# Altium schematic sheet MCU_Main.SchDoc
size A4; SheetNumber: 2; SheetTotal: 5
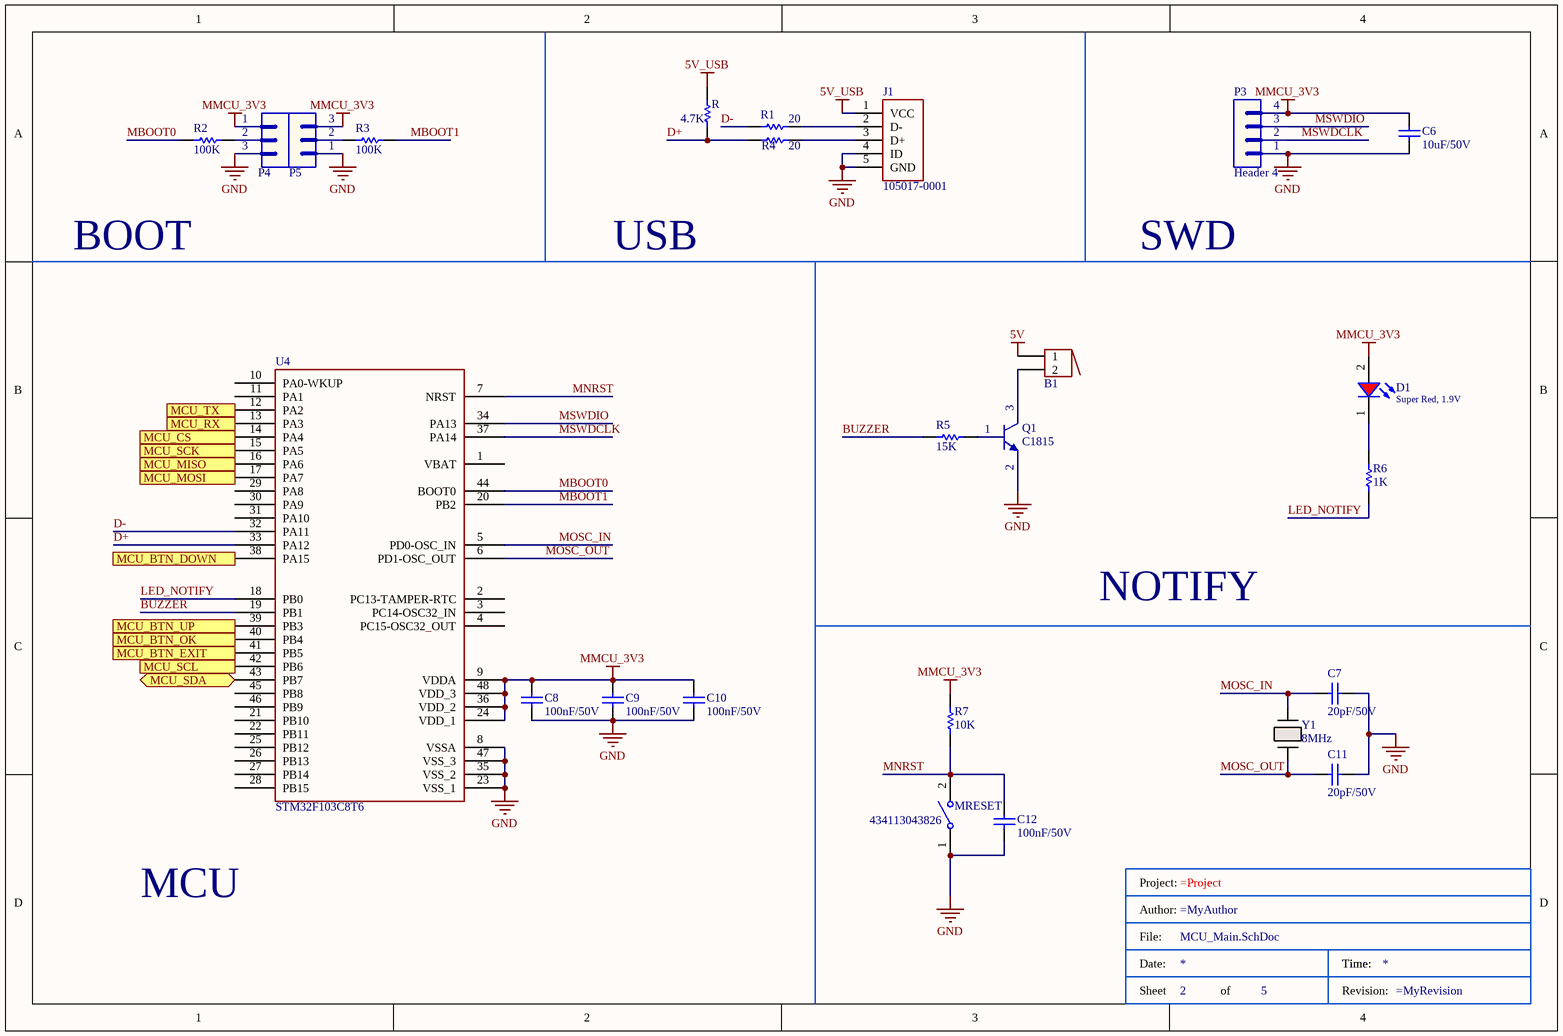
[diagram p0: MCU_Main.SchDoc]

## Parts
*  Title Block  (value not drawn)  (graphical)
B1  Buzzer  [BUZZER]  (value not drawn)
C6  value 10uF/50V  [CAP-SM-0805]  (hidden comment: Cap-10uF-50V-0805)
C7  value 20pF/50V  [CAP-SM-0805]  (hidden comment: Cap-22pF-50V-0805)
C8  value 100nF/50V  [CAP-SM-0805]  (hidden comment: Cap-100nF-50V-0805)
C9  value 100nF/50V  [CAP-SM-0805]  (hidden comment: Cap-100nF-50V-0805)
C10  value 100nF/50V  [CAP-SM-0805]  (hidden comment: Cap-100nF-50V-0805)
C11  value 20pF/50V  [CAP-SM-0805]  (hidden comment: Cap-22pF-50V-0805)
C12  value 100nF/50V  [CAP-SM-0805]  (hidden comment: Cap-100nF-50V-0805)
D1  Super Red, 1.9V  [WL-SMCW_0805]
J1  105017-0001  [Micro-USB-Female]
MRESET  434113043826  [434113043826]
P3  Header 4  [JP4]
P4  Header 3  [JP3]  (value not drawn)
P5  Header 3  [JP3]  (value not drawn)
Q1  C1815  [SOT23_NEX]
R  value 4.7K  [RES-SM-0805]  (hidden comment: Res-4.7K-0805)
R1  value 20  [RES-SM-0805]  (hidden comment: Res-270-0805)
R2  value 100K  [RES-SM-0805]  (hidden comment: Res-100K-0805)
R3  value 100K  [RES-SM-0805]  (hidden comment: Res-100K-0805)
R4  value 20  [RES-SM-0805]  (hidden comment: Res-270-0805)
R5  value 15K  [RES-SM-0805]  (hidden comment: Res-15K-0805)
R6  value 1K  [RES-SM-0805]  (hidden comment: Res-1K-0805)
R7  value 10K  [RES-SM-0805]  (hidden comment: Res-10k-0805)
U4  STM32F103C8T6  [LQFP-48]
Y1  8MHz  [xtal2_CX5032GB_AVX-L]

## Ports
MCU_BTN_DOWN (out), MCU_BTN_EXIT (out), MCU_BTN_OK (out), MCU_BTN_UP (out), MCU_CS (out), MCU_MISO (in), MCU_MOSI (out), MCU_RX (in), MCU_SCK (out), MCU_SCL (out), MCU_SDA (bidir), MCU_TX (out)

## Nets
5V: B1.1
5V_USB: J1.1(VCC) R.1
GND: C6.1 C7.1 C8.2 C9.2 C10.2 C11.1 C12.1 J1.4(ID) J1.5(GND) MRESET.1 P3.1 P4.3 P5.1 Q1.2(E) U4.8(VSSA) U4.23(VSS_1) U4.35(VSS_2) U4.47(VSS_3)
MMCU_3V3: C6.2 C8.1 C9.1 C10.1 D1.2(A) P3.4 P4.1 P5.3 R7.2 U4.9(VDDA) U4.24(VDD_1) U4.36(VDD_2) U4.48(VDD_3)
BUZZER: R5.1 U4.19(PB1)
D+: R.2 R4.2 U4.33(PA12)
D-: R1.2 U4.32(PA11)
LED_NOTIFY: R6.1 U4.18(PB0)
MBOOT0: R2.1 U4.44(BOOT0)
MBOOT1: R3.2 U4.20(PB2)
MCU_BTN_DOWN: U4.38(PA15) ; port MCU_BTN_DOWN
MCU_BTN_EXIT: U4.41(PB5) ; port MCU_BTN_EXIT
MCU_BTN_OK: U4.40(PB4) ; port MCU_BTN_OK
MCU_BTN_UP: U4.39(PB3) ; port MCU_BTN_UP
MCU_CS: U4.14(PA4) ; port MCU_CS
MCU_MISO: U4.16(PA6) ; port MCU_MISO
MCU_MOSI: U4.17(PA7) ; port MCU_MOSI
MCU_RX: U4.13(PA3) ; port MCU_RX
MCU_SCK: U4.15(PA5) ; port MCU_SCK
MCU_SCL: U4.42(PB6) ; port MCU_SCL
MCU_SDA: U4.43(PB7) ; port MCU_SDA
MCU_TX: U4.12(PA2) ; port MCU_TX
MNRST: C12.2 MRESET.2 R7.1 U4.7(NRST)
MOSC_IN: C7.2 U4.5(PD0-OSC_IN) Y1.1
MOSC_OUT: C11.2 U4.6(PD1-OSC_OUT) Y1.2
MSWDCLK: P3.2 U4.37(PA14)
MSWDIO: P3.3 U4.34(PA13)
NetB1_2: B1.2 Q1.3(C)
NetD1_1: D1.1(K) R6.2
NetJ1_2: J1.2(D-) R1.1
NetJ1_3: J1.3(D+) R4.1
NetP4_2: P4.2 R2.2
NetP5_2: P5.2 R3.1
NetQ1_1: Q1.1(B) R5.2

Not connected (* = marked no-connect by the designer): U4 1(VBAT) 2(PC13-TAMPER-RTC) 3(PC14-OSC32_IN) 4(PC15-OSC32_OUT) 10(PA0-WKUP) 11(PA1) 21(PB10) 22(PB11) 25(PB12) 26(PB13) 27(PB14) 28(PB15) 29(PA8) 30(PA9) 31(PA10) 45(PB8) 46(PB9)

## Notes on the sheet
- BOOT
- USB
- SWD
- NOTIFY
- MCU
- (in symbol Title Block) Project:; Author:; File:; Date:; Time:; Sheet; of; Revision:

## Library data of the parts
C6 = Cap-10uF-50V-0805: CAP CER 10UF 50V X5R 0805; Manufacturer: Yageo; Manufacturer Part Number: CC0805KKX5R9BB106; Local Supplier: thegioiic; Local Supplier Link: https://www.thegioiic.com/products/tu-gom-0805-10uf-50v; Supplier 1: Digikey; Supplier 1 Link: https://www.digikey.com/product-detail/en/yageo/CC0805KKX5R9BB106/311-3499-2-ND/7164383; Supplier 1 Part Number: 311-3499-2-ND
C7 C11 = Cap-22pF-50V-0805: CAP CER 22PF 100V X7R 0805; Manufacturer: Johanson Dielectrics Inc.; Manufacturer Part Number: 101X15W102MV4E; Local Supplier: thegioiic; Local Supplier Link: https://thegioiic.com/products/tu-1nf-50v-0805; Supplier 1: Digikey; Supplier 1 Link: https://www.digikey.com/product-detail/en/johanson-dielectrics-inc/101X15W102MV4E/709-1335-1-ND/2327235; Supplier 1 Part Number: 709-1335-1-ND
C8-C10 C12 = Cap-100nF-50V-0805: CAP CER 0.1UF 50V Y5V 0805; Manufacturer: Samsung Electro-Mechanics; Manufacturer Part Number: CL21F104ZBCNNNC; Local Supplier: thegioiic; Local Supplier Link: https://www.thegioiic.com/products/tu-gom-0805-100nf-0-1uf-50v; Supplier 1: Digikey; Supplier 1 Part Number: 1276-1007-1-ND; Supplier 1 Link: https://www.digikey.com/product-detail/en/samsung-electro-mechanics/CL21F104ZBCNNNC/1276-1007-1-ND/3889093
D1 = 150080SS75000: WL-SMCW SMT Mono-color Chip LED Waterclear, size 0805, Super Red, 1.9V, 140deg; Chip Technology: AlInGaP; Dominant Wavelength typ.: 630nm; Luminous Intensity typ.: 60mcd; Peak Wavelength typ.: 645nm; Viewing Angle: 140deg; ComponentLink1Description: Manufacturer; ComponentLink1URL: http://www.we-online.de; ComponentLink2URL: https://www.we-online.com/catalog/datasheet/150080SS75000.pdf; ComponentLink2Description: Datasheet; Forward Voltage typ.: 1.9V; Emitting Color: Super Red; Mounting Technology: SMT; Operating Temperature: -40 to +85degC; Published Date: December 2019; Part Number: 150080SS75000; Packaging: Tape and Reel; Size: 0805; Publisher: Wurth Elektronik
J1 = Micro-USB-Female: CONN RCPT USB2.0 MICRO B SMD R/A; Vendor: Molex Connector Corporation; Built_By: EMA_Cory; SourceLibrary: Molex_2020-05-26; Datasheet: https://www.molex.com/pdm_docs/sd/1050170001_sd.pdf; Manufacturer_Part_Number: 105017-0001; Copyright: Copyright (C) 2018 Accelerated Designs. All rights reserved; RefDes: RefDes; Type: DEV; Local Supplier: thegioiic; Local Supplier Part Number: x; Local Supplier Link: https://www.thegioiic.com/products/cong-usb-micro-b-2-0-dau-cai-5-chan-smd-v1
MRESET = 434113043826: WS-TASV J-Bend SMT Tact Switch 6x3.5mm, height 4.3mm, 260gf; Rated Voltage: 12VDC; Rated Current: 50mA; Washable: No; ComponentLink1Description: Manufacturer; ComponentLink1URL: http://www.we-online.de; ComponentLink2Description: Datasheet; ComponentLink2URL: https://katalog.we-online.com/em/datasheet/434113043826.pdf; Operating Temperature: -40 to +85degC; Part Number: 434113043826; Published Date: September 2019; Contact Material: Stainless Steel; Height: 4.3mm; Mounting Technology: SMT; Contact Plating: Silver; Operation Force: 260gf; Packaging: Tape and Reel; Terminal Material: Copper Alloy; Publisher: Wurth Elektronik; Terminal Plating: Silver; Local Supplier: thegioiic; Local Supplier Link: https://www.thegioiic.com/products/nut-nhan-3-5x6mm-cao-5mm-2-chan-smd-dau-trang; Local Supplier Part Number: x
P3 = Header 4: Header, 4-Pin; LatestRevisionDate: 17-Jul-2002; LatestRevisionNote: Re-released for DXP Platform.; Publisher: Altium Limited; Local Supplier: thegioiic; Local Supplier Part Number: x; Local Supplier Link: https://www.thegioiic.com/products/hang-rao-duc-don-2-54mm-40-chan-1-hang-cao-11-4mm-xuyen-lo
P4 P5 = Header 3: Header, 3-Pin; LatestRevisionDate: 17-Jul-2002; LatestRevisionNote: Re-released for DXP Platform.; Publisher: Altium Limited; Local Supplier: thegioiic; Local Supplier Part Number: x; Local Supplier Link: https://www.thegioiic.com/products/hang-rao-duc-don-2-54mm-40-chan-1-hang-cao-11-4mm-xuyen-lo
R = Res-4.7K-0805: RES SMD 4.7K OHM 5% 1/8W 0805; Manufacturer: Yageo; Manufacturer Part Number: RC0805JR-074K7L; Local Supplier: thegioiic; Local Supplier Link: https://www.thegioiic.com/products/dien-tro-4-7-kohm-0805-5; Supplier 1: Digikey; Supplier 1 Link: https://www.digikey.com/product-detail/en/yageo/RC0805JR-074K7L/311-4.7KARCT-ND/731274; Supplier 1 Part Number: 311-4.7KARCT-ND
R1 R4 = Res-270-0805: RES SMD 270 OHM 0.1% 0.15W 0705; Manufacturer: Vishay Dale; Manufacturer Part Number: M55342E06B270ART5; Local Supplier: thegioiic; Local Supplier Link: https://thegioiic.com/products/dien-tro-270-ohm-0805-5; Supplier 1: Digikey; Supplier 1 Link: https://www.digikey.com/product-detail/en/vishay-dale/M55342E06B270ART5/1135-1723-6-ND/3197905; Supplier 1 Part Number: 1135-1723-6-ND
R2 R3 = Res-100K-0805: RES 0 OHM JUMPER 0805; Manufacturer: Vishay Dale; Manufacturer Part Number: WSL080500000ZEA9; Local Supplier: thegioiic; Local Supplier Link: https://www.thegioiic.com/products/dien-tro-100-kohm-0805-5; Supplier 1: Digikey; Supplier 1 Link: https://www.digikey.com/product-detail/en/vishay-dale/WSL080500000ZEA9/541-3928-1-ND/7423223; Supplier 1 Part Number: 541-3928-1-ND
R5 = Res-15K-0805: RES 15K OHM 1% 1/4W 0805; Manufacturer: TE Connectivity Passive Product; Manufacturer Part Number: CRGCQ0805F15K; Local Supplier: thegioiic; Local Supplier Link: https://www.thegioiic.com/products/dien-tro-15-kohm-0805-5; Supplier 1: Digikey; Supplier 1 Part Number: A129763CT-ND; Supplier 1 Link: https://www.digikey.com/product-detail/en/te-connectivity-passive-product/CRGCQ0805F15K/A129763CT-ND/8577595
R6 = Res-1K-0805: RES 1K OHM 1% 1/4W 0805; Manufacturer: Stackpole Electronics Inc; Manufacturer Part Number: RNCP0805FTD1K00; Local Supplier: thegioiic; Local Supplier Link: https://www.thegioiic.com/products/dien-tro-1-kohm-0805-5; Supplier 1: Digikey; Supplier 1 Link: https://www.digikey.com/product-detail/en/stackpole-electronics-inc/RNCP0805FTD1K00/RNCP0805FTD1K00CT-ND/2240568; Supplier 1 Part Number: RNCP0805FTD1K00CT-ND
R7 = Res-10k-0805: RES 10K OHM 1% 1/4W 0805; Manufacturer: Stackpole Electronics Inc; Manufacturer Part Number: RNCP0805FTD10K0; Local Supplier: thegioiic; Local Supplier Link: https://www.thegioiic.com/products/dien-tro-10-kohm-0805-5; Supplier 1: Digikey; Supplier 1 Link: https://www.digikey.com/product-detail/en/stackpole-electronics-inc/RNCP0805FTD10K0/RNCP0805FTD10K0CT-ND/2240601; Supplier 1 Part Number: RNCP0805FTD10K0CT-ND
U4 = STM32F103C8T6: Manufacturer: ST Electronic; Manufacture Part Number: STM32F103C8T6; Local Supplier: thegioiic; Local Supplier Part Number: STM32F103C8T6; Local Supplier Link: https://www.thegioiic.com/products/stm32f103c8t6
Y1 = XTAL: No Description Available; Mfr_Name: KYOCERA AVX; Manufacturer_Part_Number: CX5032GB08000H0HEQZ1; Copyright: Copyright (C) 2023 Ultra Librarian. All rights reserved.; RefDes: RefDes; Type: DEV
B1 = Buzzer: Local Supplier: thegioiic; Local Supplier Link: https://www.thegioiic.com/products/1209-dip-buzzer-12x9mm; Local Supplier Part Number: 1209 DIP Buzzer 12x9mm